# EAGLE design LDR_circuit (EAGLE 7.2.0)
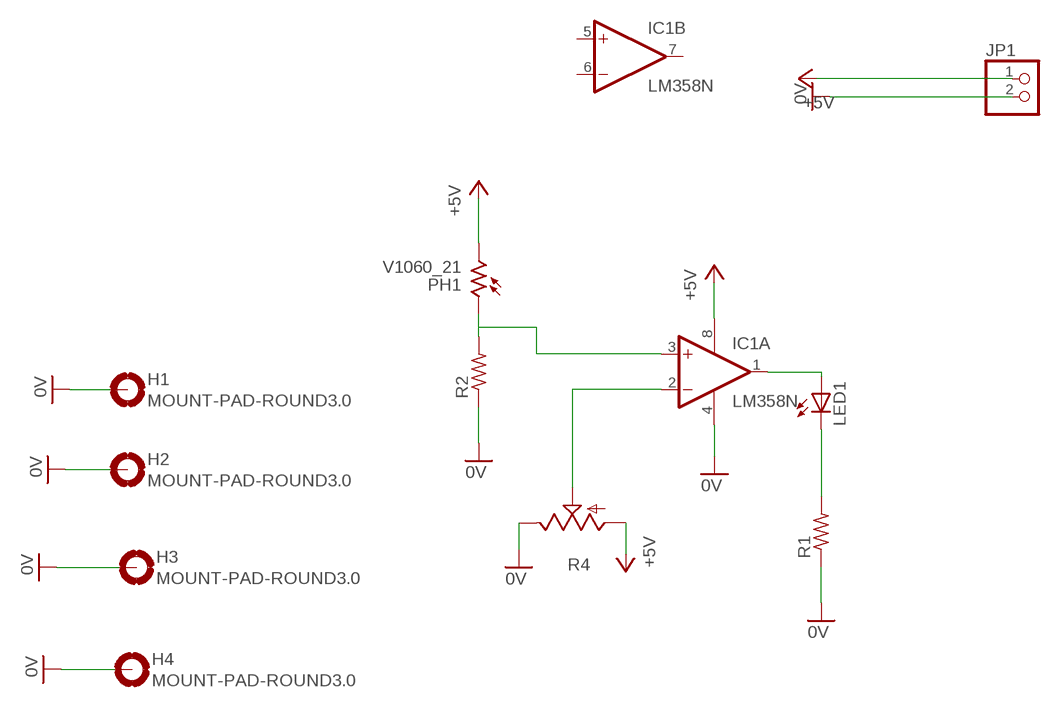
[diagram p0: schematic, sheet 1]

## Parts
H1  MOUNT-PAD-ROUND3.0  [3,0-PAD]
H2  MOUNT-PAD-ROUND3.0  [3,0-PAD]
H3  MOUNT-PAD-ROUND3.0  [3,0-PAD]
H4  MOUNT-PAD-ROUND3.0  [3,0-PAD]
IC1  LM358N  [DIL08]
JP1  PINHD-1X2  [1X02]
LED1  LED5MM  [LED5MM]
PH1  V1060_21  [TO-5_V10]
R1  R-US_0207/10  [0207/10]
R2  R-US_0207/10  [0207/10]
R4  TRIM_US-CA6V  [CA6V]

## Nets
0V: H1.B3,0(MOUNT) H2.B3,0(MOUNT) H3.B3,0(MOUNT) H4.B3,0(MOUNT) IC1.4(P:V-) JP1.2 R1.1 R2.1 R4.E
+5V: IC1.8(P:V+) JP1.1 PH1.2 R4.A
N$1: LED1.K(C) R1.2
N$2: IC1.1(A:OUT) LED1.A
N$3: IC1.3(A:+IN) PH1.1 R2.2
N$5: IC1.2(A:-IN) R4.S
Unconnected: IC1.5(B:+IN) IC1.6(B:-IN) IC1.7(B:OUT)

## Library data of the parts
H1-H4 = holes:MOUNT-PAD-ROUND: MOUNTING PAD, round
IC1 = linear:LM358: OP AMP also LM158; LM258; LM2904 Source: http://cache.national.com/ds/LM/LM158.pdf
JP1 = pinhead:PINHD-1X2: PIN HEADER
LED1 = led:LED: LED OSRAM: - CHIPLED LG R971, LG N971, LY N971, LG Q971, LY Q971, LO R971, LY R971 LH N974, LH R974 LS Q976, LO Q976, LY Q976 LO Q996 - Hyper CHIPLED LW Q18S LB Q993, LB Q99A, LB R99A - SideLED LS A670, LO A670, LY A670, LG A670, LP A670 LB A673, LV A673, LT A673, LW A673 LH A674 LY A675 LS A676, LA A676, LO A676, LY A676, LW A676 LS A679, LY A679, LG A679 - Hyper Micro SIDELED® LS Y876, LA Y876, LO Y876, LY Y876 LT Y87S - SmartLED LW L88C, LW L88S LB L89C, LB L89S, LG L890 LS L89K, LO L89K, LY L89K LS L896, LA L896, LO L896, LY L896 - TOPLED LS T670, LO T670, LY T670, LG T670, LP T670 LSG T670, LSP T670, LSY T670, LOP T670, LYG T670 LG T671, LOG T671, LSG T671 LB T673, LV T673, LT T673, LW T673 LH T674 LS T676, LA T676, LO T676, LY T676, LB T676, LH T676, LSB T676, LW T676 LB T67C, LV T67C, LT T67C, LS T67K, LO T67K, LY T67K, LW E67C LS E67B, LA E67B, LO E67B, LY E67B, LB E67C, LV E67C, LT E67C LW T67C LS T679, LY T679, LG T679 LS T770, LO T770, LY T770, LG T770, LP T770 LB T773, LV T773, LT T773, LW T773 LH T774 LS E675, LA E675, LY E675, LS T675 LS T776, LA T776, LO T776, LY T776, LB T776 LHGB T686 LT T68C, LB T68C - Hyper Mini TOPLED® LB M676 - Mini TOPLED Santana® LG M470 LS M47K, LO M47K, LY M47K Source: http://www.osram.convergy.de LUXEON: - LUMILED® LXK2-PW12-R00, LXK2-PW12-S00, LXK2-PW14-U00, LXK2-PW14-V00 LXK2-PM12-R00, LXK2-PM12-S00, LXK2-PM14-U00 LXK2-PE12-Q00, LXK2-PE12-R00, LXK2-PE12-S00, LXK2-PE14-T00, LXK2-PE14-U00 LXK2-PB12-K00, LXK2-PB12-L00, LXK2-PB12-M00, LXK2-PB14-N00, LXK2-PB14-P00, LXK2-PB14-Q00 LXK2-PR12-L00, LXK2-PR12-M00, LXK2-PR14-Q00, LXK2-PR14-R00 LXK2-PD12-Q00, LXK2-PD12-R00, LXK2-PD12-S00 LXK2-PH12-R00, LXK2-PH12-S00 LXK2-PL12-P00, LXK2-PL12-Q00, LXK2-PL12-R00 Source: www.luxeon.com KINGBRIGHT: KA-3528ASYC Source: www.kingbright.com
PH1 = photo-elements:?1060*: Sensor Street Light control Source: http://optoelectronics.perkinelmer.com/content/Datasheets/DTS_PhotocellsB1060.pdf
R1 R2 = rcl:R-US_: RESISTOR, American symbol
R4 = pot:TRIM_US-: POTENTIOMETER

## Board
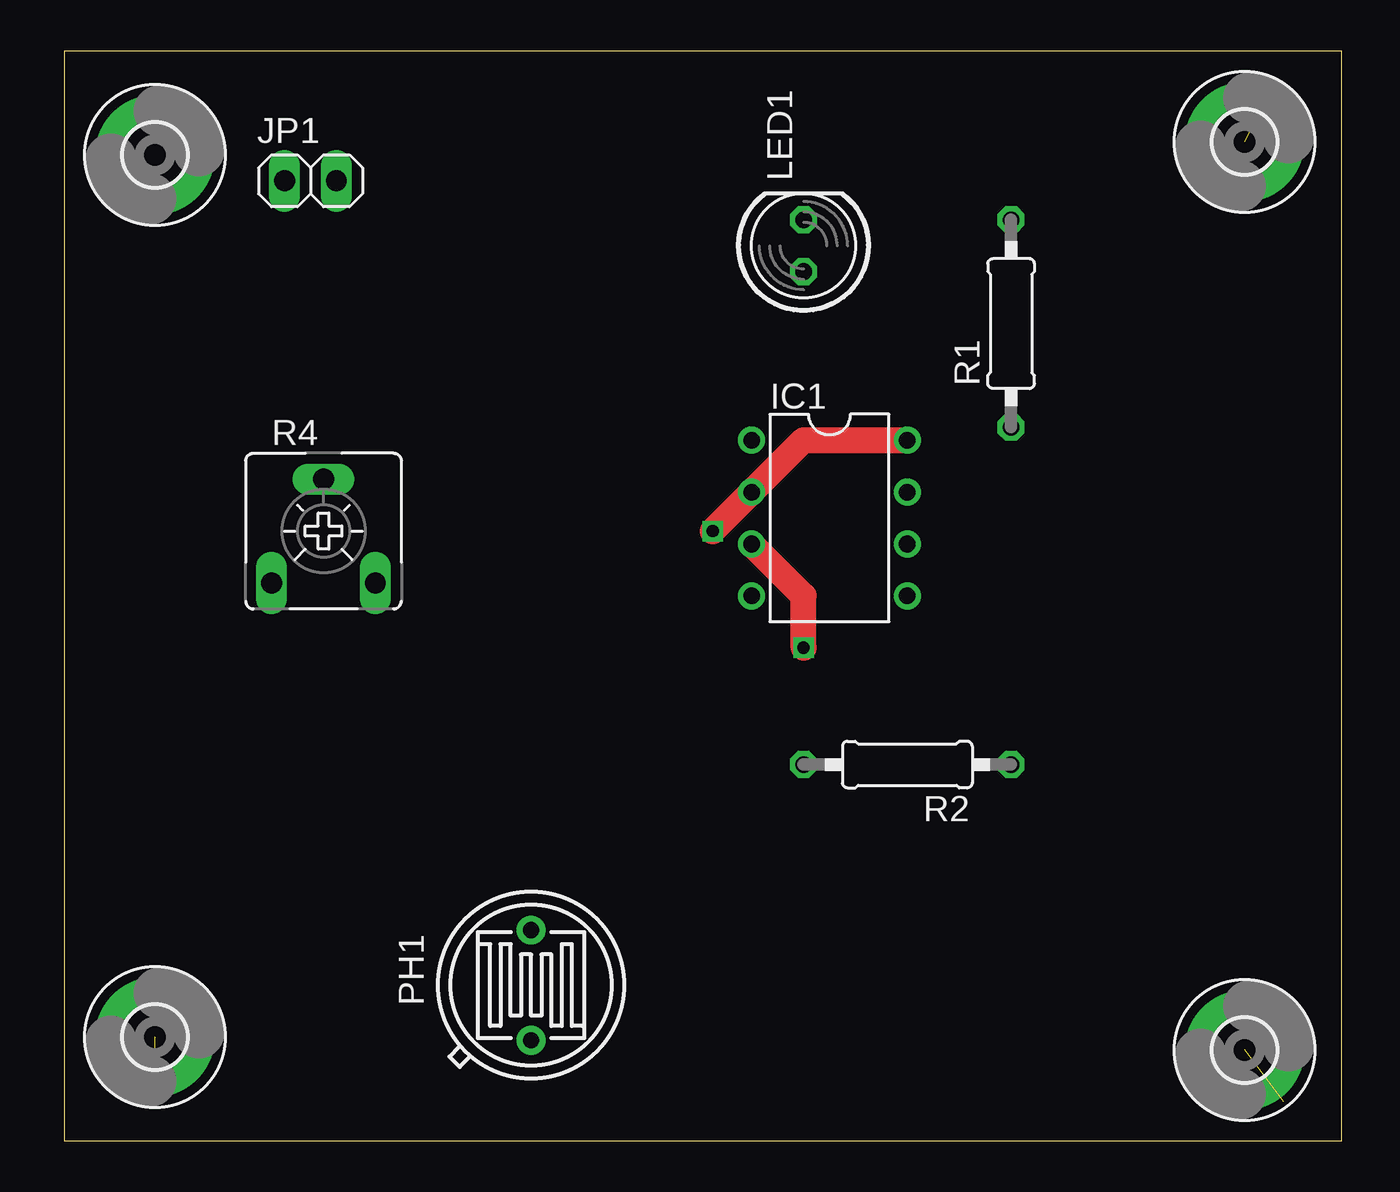
[diagram p1: board, top side]
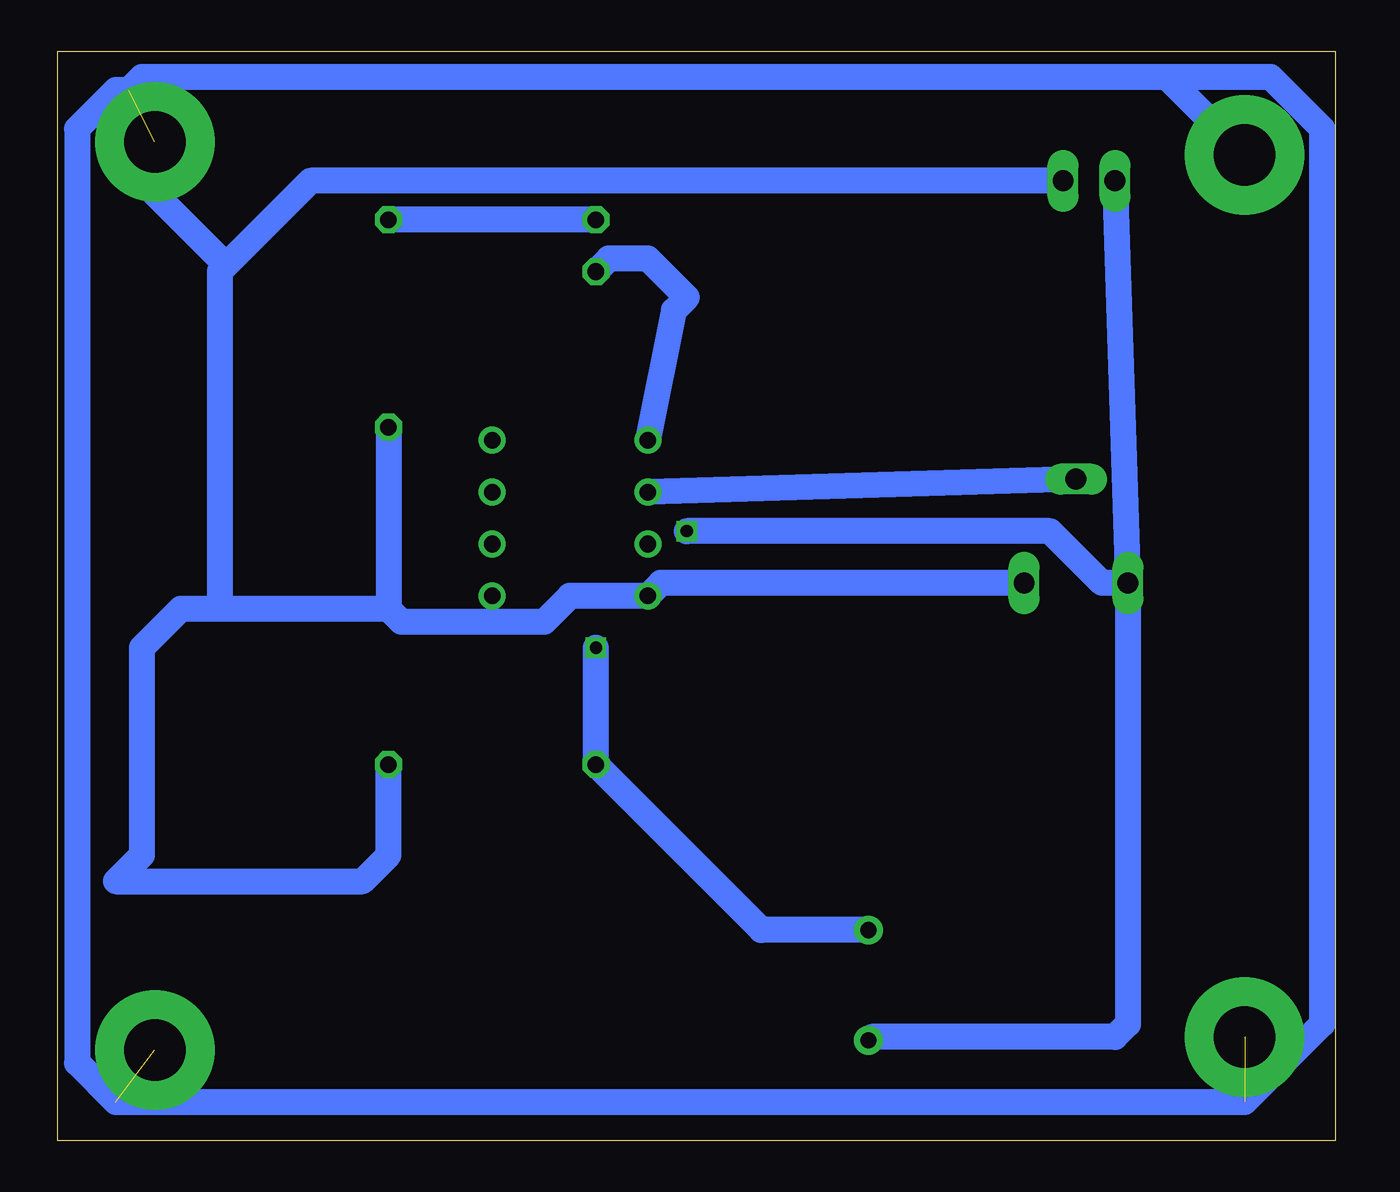
[diagram p2: board, bottom side, seen from below]

Size 62.54 x 53.33 mm. Coordinates in mm from the lower left corner, seen from the top.
Outline: 0,0 62.54,0 62.54,53.33 0,53.33 0,0
Copper layers (1*16): Top 0.035mm / dielectric 1.5mm / Bottom 0.035mm
Design rules "default": minimum track width 10mil, minimum drill 24mil, track to track 8mil, track to pad 8mil, pad to pad 8mil, via to via 8mil, smd to smd 8mil, copper to edge 40mil, drill to drill 8mil, minimum pad ring 10mil, minimum via ring 8mil, stop-mask expansion 4mil, vias tented up to drill 0mil, thermal gap 10mil

### Footprints (pad centres in the part's own frame; a part is rotated, then mirrored left to right if it is on the bottom)
3,0-PAD = drill 3 pad 5.842: B3,0 0,0
DIL08 = drill 0.813 pad 1.27: 1 -3.81,-3.81; 2 -1.27,-3.81; 3 1.27,-3.81; 4 3.81,-3.81; 5 3.81,3.81; 6 1.27,3.81; 7 -1.27,3.81; 8 -3.81,3.81
1X02 = drill 1.016 long: 1 -1.27,0; 2 1.27,0
LED5MM = drill 0.813 octagon: A -1.27,0; K 1.27,0
TO-5_V10 = drill 0.8 pad 1.4: 1 -2.7,0; 2 2.7,0
0207/10 = drill 0.813 octagon: 1 -5.08,0; 2 5.08,0
CA6V = drill 1.016 long: A -2.54,-2.54; E 2.54,-2.54; S 0,2.54

### Placement (x,y rotation side)
H1  57.79,4.45 0 top
H2  57.79,48.89 0 top
H3  4.45,48.26 0 top
H4  4.45,5.08 0 top
IC1  37.46,30.48 270 top
JP1  12.06,46.99 0 top
LED1  36.2,43.81 90 top
PH1  22.86,7.62 270 top
R1  46.35,40 90 top
R2  41.27,18.41 180 top
R4  12.7,29.85 0 top

### Tracks (layer width: path | path; a pad name or v marks a point on that pad's centre or on a via)
0V  (3 unrouted)
  Bottom 1.27: R1.1 46.35,26.04 | 46.35,26.04 54.61,26.04 | 54.61,26.04 56.51,26.04 58.42,24.13 58.42,13.97 59.69,12.7 47.62,12.7 46.35,13.97 R2.1 | JP1.2 50.16,46.99 54.29,42.86 | 54.29,42.86 54.61,42.55 54.61,26.04 | R4.E 33.02,27.31 IC1.4 37.46,26.67 38.73,25.4 45.72,25.4 46.35,26.04 | H3.B3,0 8.25,52.07 | 8.25,52.07 58.42,52.07 59.05,51.44 59.69,51.44 61.59,49.53 61.59,3.81 59.69,1.9 4.45,1.9 0.63,5.71 0.63,49.53 3.17,52.07 8.25,52.07 | H2.B3,0 57.79,46.36 54.29,42.86
+5V  (via drill 0.6)
  Top 1.27: v31.75,29.85 36.2,34.29 IC1.8
  Bottom 1.27: JP1.1 R4.A | R4.A 10.16,5.71 10.79,5.08 22.7,5.08 PH1.2 | R4.A 11.43,27.31 13.97,29.85 v31.75,29.85
N$1
  Bottom 1.27: LED1.K R1.2
N$2
  Bottom 1.27: IC1.1 32.38,40.64 31.75,41.28 33.65,43.18 35.56,43.18 LED1.A
N$3  (via drill 0.6)
  Top 1.27: v36.2,24.13 36.2,26.67 IC1.3
  Bottom 1.27: PH1.1 28.1,10.32 R2.2 v36.2,24.13
N$5
  Bottom 1.27: R4.S IC1.2